# Altium schematic sheet Sheet1.SchDoc
size A2; SheetNumber: 1; SheetTotal: 1
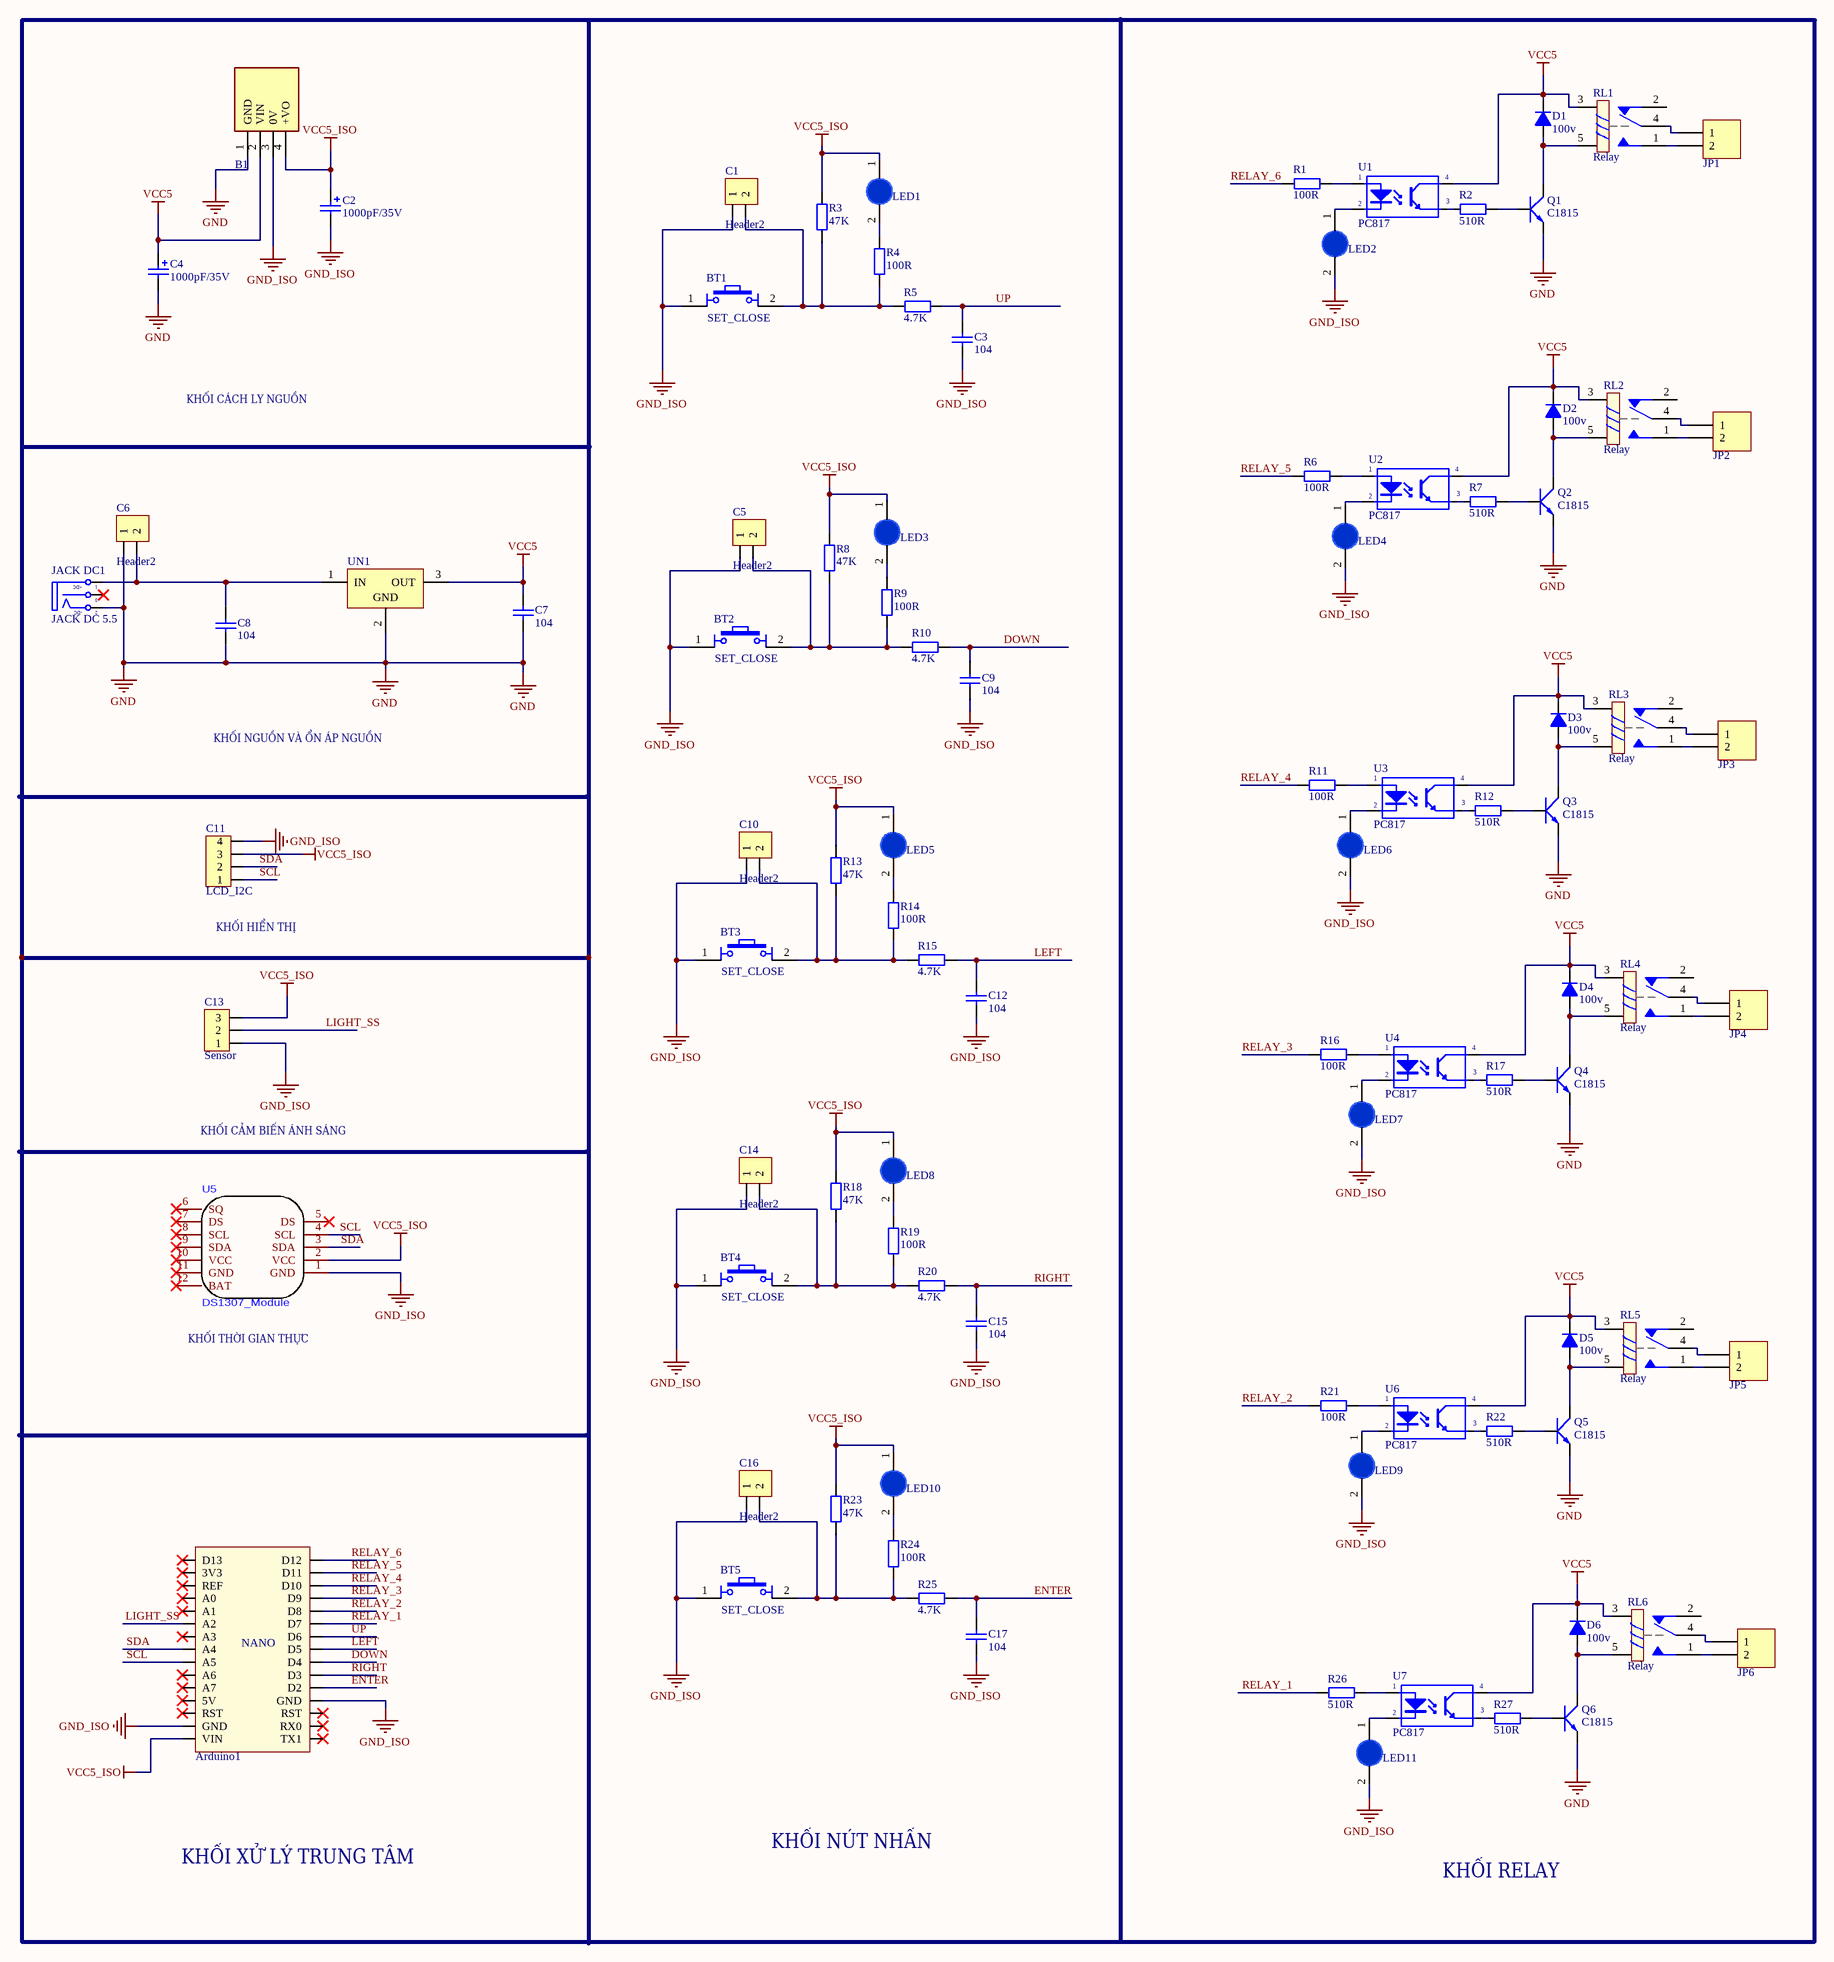
[diagram p0: Sheet1.SchDoc]

## Parts
Arduino1  Arduino Nano  [Arduino Nano]  (value not drawn)
B1  B0505S1W  [B0505S1W]  (value not drawn)
BT1  SET_CLOSE  [Nut Nhan 4 Chan Cam 6x6]
BT2  SET_CLOSE  [Nut Nhan 4 Chan Cam 6x6]
BT3  SET_CLOSE  [Nut Nhan 4 Chan Cam 6x6]
BT4  SET_CLOSE  [Nut Nhan 4 Chan Cam 6x6]
BT5  SET_CLOSE  [Nut Nhan 4 Chan Cam 6x6]
C1  Header2  [Header2]
C2  value 1000pF/35V  [CP2/5]  (hidden comment: Cap Pol3)
C3  104  [tu gom]
C4  value 1000pF/35V  [CP2/5]  (hidden comment: Cap Pol3)
C5  Header2  [Header2]
C6  Header2  [Header2]
C7  104  [tu gom]
C8  104  [tu gom]
C9  104  [tu gom]
C10  Header2  [Header2]
C11  LCD_I2C  [Header4]
C12  104  [tu gom]
C13  Sensor  [Header3]
C14  Header2  [Header2]
C15  104  [tu gom]
C16  Header2  [Header2]
C17  104  [tu gom]
D1  100v  [DIODE 0.5A]
D2  100v  [DIODE 0.5A]
D3  100v  [DIODE 0.5A]
D4  100v  [DIODE 0.5A]
D5  100v  [DIODE 0.5A]
D6  100v  [DIODE 0.5A]
JACK_DC1  JACK DC 5.5  [JACK DC 5.5]
JP1  Header 2_1  [HED2]  (value not drawn)
JP2  Header 2_1  [HED2]  (value not drawn)
JP3  Header 2_1  [HED2]  (value not drawn)
JP4  Header 2_1  [HED2]  (value not drawn)
JP5  Header 2_1  [HED2]  (value not drawn)
JP6  Header 2_1  [HED2]  (value not drawn)
LED1  LED 3mm  [LED-3MM-BLUE]  (value not drawn)
LED2  LED 3mm  [LED-3MM-BLUE]  (value not drawn)
LED3  LED 3mm  [LED-3MM-BLUE]  (value not drawn)
LED4  LED 3mm  [LED-3MM-BLUE]  (value not drawn)
LED5  LED 3mm  [LED-3MM-BLUE]  (value not drawn)
LED6  LED 3mm  [LED-3MM-BLUE]  (value not drawn)
LED7  LED 3mm  [LED-3MM-BLUE]  (value not drawn)
LED8  LED 3mm  [LED-3MM-BLUE]  (value not drawn)
LED9  LED 3mm  [LED-3MM-BLUE]  (value not drawn)
LED10  LED 3mm  [LED-3MM-BLUE]  (value not drawn)
LED11  LED 3mm  [LED-3MM-BLUE]  (value not drawn)
Q1  C1815  [C1815_cam]
Q2  C1815  [C1815_cam]
Q3  C1815  [C1815_cam]
Q4  C1815  [C1815_cam]
Q5  C1815  [C1815_cam]
Q6  C1815  [C1815_cam]
R1  100R  [R1/4W]
R2  510R  [R1/4W]
R3  47K  [R1/4W]
R4  100R  [R1/4W]
R5  4.7K  [R1/4W]
R6  100R  [R1/4W]
R7  510R  [R1/4W]
R8  47K  [R1/4W]
R9  100R  [R1/4W]
R10  4.7K  [R1/4W]
R11  100R  [R1/4W]
R12  510R  [R1/4W]
R13  47K  [R1/4W]
R14  100R  [R1/4W]
R15  4.7K  [R1/4W]
R16  100R  [R1/4W]
R17  510R  [R1/4W]
R18  47K  [R1/4W]
R19  100R  [R1/4W]
R20  4.7K  [R1/4W]
R21  100R  [R1/4W]
R22  510R  [R1/4W]
R23  47K  [R1/4W]
R24  100R  [R1/4W]
R25  4.7K  [R1/4W]
R26  510R  [R1/4W]
R27  510R  [R1/4W]
RL1  Relay  [RELAY_SRA_05VDC_CL]
RL2  Relay  [RELAY_SRA_05VDC_CL]
RL3  Relay  [RELAY_SRA_05VDC_CL]
RL4  Relay  [RELAY_SRA_05VDC_CL]
RL5  Relay  [RELAY_SRA_05VDC_CL]
RL6  Relay  [RELAY_SRA_05VDC_CL]
U1  PC817  [DIP4/W0.3]
U2  PC817  [DIP4/W0.3]
U3  PC817  [DIP4/W0.3]
U4  PC817  [DIP4/W0.3]
U5  DS1307_Module  [DS1307 MODULE]
U6  PC817  [DIP4/W0.3]
U7  PC817  [DIP4/W0.3]
UN1  L78M05CP  [QTO-220H2]  (value not drawn)

## Nets
GND: B1.1(GND) C4.2 C6.1 C7.2 C8.2 JACK_DC1.2(TN) Q1.1(E) Q2.1(E) Q3.1(E) Q4.1(E) Q5.1(E) Q6.1(E) UN1.2(GND)
GND_ISO: Arduino1.GND B1.3(0V) BT1.1 BT2.1 BT3.1 BT4.1 BT5.1 C1.1 C2.2 C3.2 C5.1 C9.2 C10.1 C11.4 C12.2 C13.1 C14.1 C15.2 C16.1 C17.2 LED2.2(K) LED4.2(K) LED6.2(K) LED7.2(K) LED9.2(K) LED11.2(K) U5.1(GND)
VCC5: B1.2(VIN) C4.1 C7.1 D1.2(K) D2.2(K) D3.2(K) D4.2(K) D5.2(K) D6.2(K) RL1.3 RL2.3 RL3.3 RL4.3 RL5.3 RL6.3 U1.4(C) U2.4(C) U3.4(C) U4.4(C) U6.4(C) U7.4(C) UN1.3(OUT)
VCC5_ISO: Arduino1.VIN B1.4(+VO) C2.1 C11.3 C13.3 LED1.1(A) LED3.1(A) LED5.1(A) LED8.1(A) LED10.1(A) R3.2 R8.2 R13.2 R18.2 R23.2 U5.2(VCC)
DOWN: Arduino1.D4 C9.1 R10.1
ENTER: Arduino1.D2 C17.1 R25.1
LEFT: Arduino1.D5 C12.1 R15.1
LIGHT_SS: Arduino1.A2 C13.2
RELAY_1: Arduino1.D7 R26.1
RELAY_2: Arduino1.D8 R21.1
RELAY_3: Arduino1.D9 R16.1
RELAY_4: Arduino1.D10 R11.1
RELAY_5: Arduino1.D11 R6.1
RELAY_6: Arduino1.D12 R1.1
RIGHT: Arduino1.D3 C15.1 R20.1
SCL: Arduino1.A5 C11.1 U5.4(SCL)
SDA: Arduino1.A4 C11.2 U5.3(SDA)
UP: Arduino1.D6 C3.1 R5.1
NetBT1_2: BT1.2 C1.2 R3.1 R4.1 R5.2
NetBT2_2: BT2.2 C5.2 R8.1 R9.1 R10.2
NetBT3_2: BT3.2 C10.2 R13.1 R14.1 R15.2
NetBT4_2: BT4.2 C14.2 R18.1 R19.1 R20.2
NetBT5_2: BT5.2 C16.2 R23.1 R24.1 R25.2
NetC6_2: C6.2 C8.1 JACK_DC1.1(T) UN1.1(IN)
NetD1_1: D1.1(A) Q1.2(C) RL1.5
NetD2_1: D2.1(A) Q2.2(C) RL2.5
NetD3_1: D3.1(A) Q3.2(C) RL3.5
NetD4_1: D4.1(A) Q4.2(C) RL4.5
NetD5_1: D5.1(A) Q5.2(C) RL5.5
NetD6_1: D6.1(A) Q6.2(C) RL6.5
NetJP1_1: JP1.1 RL1.4
NetJP1_2: JP1.2 RL1.1
NetJP2_1: JP2.1 RL2.4
NetJP2_2: JP2.2 RL2.1
NetJP3_1: JP3.1 RL3.4
NetJP3_2: JP3.2 RL3.1
NetJP4_1: JP4.1 RL4.4
NetJP4_2: JP4.2 RL4.1
NetJP5_1: JP5.1 RL5.4
NetJP5_2: JP5.2 RL5.1
NetJP6_1: JP6.1 RL6.4
NetJP6_2: JP6.2 RL6.1
NetLED1_2: LED1.2(K) R4.2
NetLED2_1: LED2.1(A) U1.2(K)
NetLED3_2: LED3.2(K) R9.2
NetLED4_1: LED4.1(A) U2.2(K)
NetLED5_2: LED5.2(K) R14.2
NetLED6_1: LED6.1(A) U3.2(K)
NetLED7_1: LED7.1(A) U4.2(K)
NetLED8_2: LED8.2(K) R19.2
NetLED9_1: LED9.1(A) U6.2(K)
NetLED10_2: LED10.2(K) R24.2
NetLED11_1: LED11.1(A) U7.2(K)
NetQ1_3: Q1.3(B) R2.2
NetQ2_3: Q2.3(B) R7.2
NetQ3_3: Q3.3(B) R12.2
NetQ4_3: Q4.3(B) R17.2
NetQ5_3: Q5.3(B) R22.2
NetQ6_3: Q6.3(B) R27.2
NetR1_2: R1.2 U1.1(A)
NetR2_1: R2.1 U1.3(E)
NetR6_2: R6.2 U2.1(A)
NetR7_1: R7.1 U2.3(E)
NetR11_2: R11.2 U3.1(A)
NetR12_1: R12.1 U3.3(E)
NetR16_2: R16.2 U4.1(A)
NetR17_1: R17.1 U4.3(E)
NetR21_2: R21.2 U6.1(A)
NetR22_1: R22.1 U6.3(E)
NetR26_2: R26.2 U7.1(A)
NetR27_1: R27.1 U7.3(E)

Not connected (* = marked no-connect by the designer): Arduino1 3V3* 5V* A0* A1* A3* A6* A7* D13* REF* RST* RX0* TX1*; JACK_DC1 3(S)*; RL1 2; RL2 2; RL3 2; RL4 2; RL5 2; RL6 2; U5 5(DS)* 6(SQ)* 7(DS)* 8(SCL)* 9(SDA)* 10(VCC)* 11(GND)* 12(BAT)*

## Notes on the sheet
- KHỐI CÁCH LY NGUỒN
- KHỐI NGUỒN VÀ ỔN ÁP NGUỒN
- (near C11) KHỐI HIỂN THỊ
- KHỐI CẢM BIẾN ÁNH SÁNG
- (near U5) KHỐI THỜI GIAN THỰC
- KHỐI XỬ LÝ TRUNG TÂM
- KHỐI NÚT NHẤN
- KHỐI RELAY
- (in symbol Arduino Nano) NANO
- (in symbol JACK DC 5.5) +DC; -DC

## Library data of the parts
Arduino1 = Arduino Nano: Value: Cau 1A
B1 = B0505S1W: Power Supply; Manufacturer_Name: Mornsun; Manufacturer_Part_Number: B0505S-1W; Datasheet Link: https://www.mornsun-power.com/uploads/pdf/B_D-1W.pdf; Height: 10.41mm
BT1-BT5 = Nut Nhan 4 Chan Cam 6x6: Nut Nhan 4 Chan 6x6mm; Ten: Nút Nhấn 4 Chân 6x6x5MM DIP; Ma_Hang: MH004584
C1 C5 C6 C10 C14 C16 = Header2: Header IDC, 2 x 1 Pin Vertical 2.54mm Pitch (Non-Boxed, Male); Manufacturer: W¨¹rth Elektronik eiSos GmbH; partNo: 613002143121; ComponentLink1 Description: Manufacturer; ComponentLink2 Description: Datasheet; NoPins: 02; Created Date: 29 March 2013; ComponentLink1URL: http://www.we-online.com; ComponentLink2URL: http://katalog.we-online.de/em/datasheet/6130xx143121.pdf; Created by: Karrer Zheng
C2 C4 = Cap Pol3: Polarized Capacitor (Surface Mount); VALUE: C?; LatestRevisionDate: 17-Jul-2002; LatestRevisionNote: Re-released for DXP Platform.; PackageReference: C0805; Publisher: Altium Limited
C3 C7-C9 C12 C15 C17 = Tu gom 104 50V: Cắm; So_Chan: 2; Ten_Linh_Kien: Tụ gốm 104 100nF 50V; Don_Vi: Con; Ma_Hang: MH004761; Chung_Loai: Cắm; Kieu_Chan: *
C11 = Header4: Header IDC, 4 x 1 Pin Vertical 2.54mm Pitch (Non-Boxed, Male); Manufacturer: W¨¹rth Elektronik eiSos GmbH; partNo: 613002143121; ComponentLink1 Description: Manufacturer; ComponentLink2 Description: Datasheet; NoPins: 02; Created Date: 29 March 2013; ComponentLink1URL: http://www.we-online.com; ComponentLink2URL: http://katalog.we-online.de/em/datasheet/6130xx143121.pdf; Created by: Karrer Zheng
C13 = Header3: Header IDC, 3 x 1 Pin Vertical 2.54mm Pitch (Non-Boxed, Male); Manufacturer: W¨¹rth Elektronik eiSos GmbH; partNo: 613002143121; ComponentLink1 Description: Manufacturer; ComponentLink2 Description: Datasheet; NoPins: 02; Created Date: 29 March 2013; ComponentLink1URL: http://www.we-online.com; ComponentLink2URL: http://katalog.we-online.de/em/datasheet/6130xx143121.pdf; Created by: Karrer Zheng
D1-D6 = Diode 1N4148: Cắm; Ten_Linh_Kien: Diode 1N4148 DO35 450mA 100V ( 1N4148 DIP); Don_Vi: Con; Ma_Hang: MH001065; Ghi Chu: *; Kieu_Chan: *; Chung_Loai: Cắm
JACK_DC1 = JACK DC 5.5: Value: Jac DC
JP1-JP6 = Header 2_1: Header, 2-Pin; Manufacturer: Generic Components; Class: Connector; Value: Header 2
LED1-LED11 = LED 3mm Xanh Duong: Cắm; Don_Vi: Con; Ma_Hang: MH009003; Ten_Linh_Kien: LED 3MM Xanh Dương SS (1000c); Ghi_Chu: *; Kieu_Chan: *; Chung_Loai: Cắm
Q1-Q6 = C1815: NPN 600mW, ECB; Value: C1815
R1-R27 = R1/4W: Resistor 1/4W; Value: R1/4W - 1K
RL1-RL6 = RL_SRA-05VDC-CL: Relay 5 Chan; Ma_Hang: MH009374; Ten: Relay 5V10A SRD-05VDC-SL-C Chính Hãng
U1-U4 U6 U7 = PC817: Single Opto; Value: PC817
UN1 = L78M05CP: Positive Voltage Regulator; Note: Tab is connected to pin 3 (GND).; Published: 24-Aug-2001; LatestRevisionDate: 17-Jul-2002; LatestRevisionNote: Re-released for DXP Platform.; DatasheetVersion: Apr-1994; PackageVersion: Jul-1998; PackageReference: ISOWATT220AB; Publisher: Altium Limited; PackageDescription: TO, Thru-Hole, Vertical, Heatsink Mounted; 3 In-Line Leads; Pitch 2.54 mm; Pin sequence 1, 3, 2; ComponentLink1Description: Manufacturer Link; ComponentLink1URL: http://www.st.com/; ComponentLink2Description: Datasheet; ComponentLink2URL: http://www.st.com/stonline/products/literature/ds/2146/l78m05c.pdf